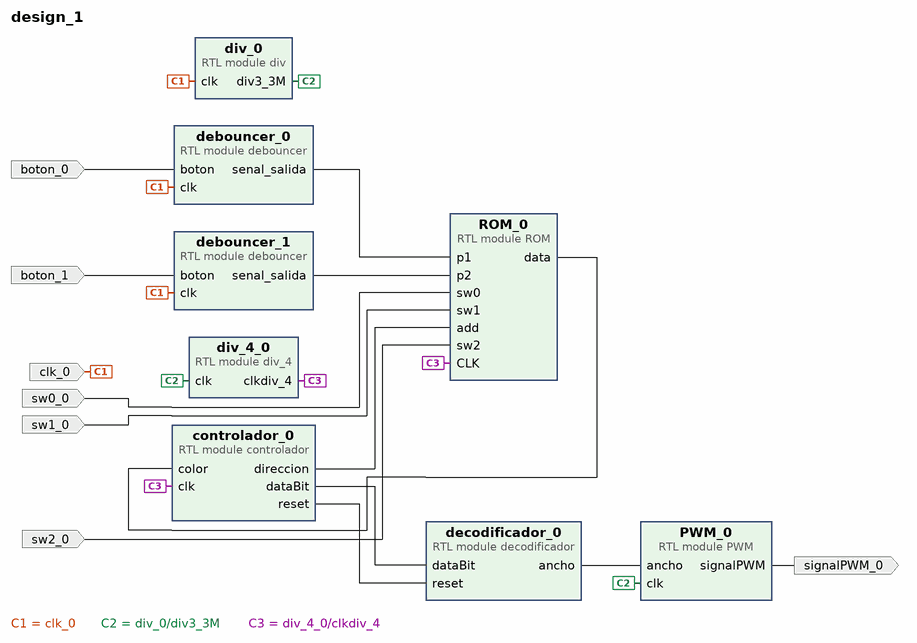
[diagram p0: block diagram of the top level]
# Vivado block design design_1, xc7s15ftgb196-1, Vivado 2022.2
create_bd_design design_1

create_bd_port -dir I -type clk clk_0
create_bd_port -dir I boton_0
create_bd_port -dir O signalPWM_0
create_bd_port -dir I boton_1
create_bd_port -dir I sw0_0
create_bd_port -dir I sw1_0
create_bd_port -dir I sw2_0

create_bd_cell -type module -reference PWM PWM_0
create_bd_cell -type module -reference controlador controlador_0
create_bd_cell -type module -reference decodificador decodificador_0
create_bd_cell -type module -reference div div_0
create_bd_cell -type module -reference div_4 div_4_0
create_bd_cell -type module -reference debouncer debouncer_0
create_bd_cell -type module -reference debouncer debouncer_1
create_bd_cell -type module -reference ROM ROM_0

# ---- connections ----

connect_bd_net [get_bd_pins PWM_0/signalPWM] [get_bd_ports signalPWM_0]
connect_bd_net [get_bd_pins ROM_0/data] [get_bd_pins controlador_0/color]
connect_bd_net -net boton_0_1 [get_bd_ports boton_0] [get_bd_pins debouncer_0/boton]
connect_bd_net -net boton_1_1 [get_bd_ports boton_1] [get_bd_pins debouncer_1/boton]
connect_bd_net -net clk_0_1 [get_bd_ports clk_0] [get_bd_pins div_0/clk] [get_bd_pins debouncer_0/clk] [get_bd_pins debouncer_1/clk]
connect_bd_net [get_bd_pins controlador_0/dataBit] [get_bd_pins decodificador_0/dataBit]
connect_bd_net [get_bd_pins controlador_0/direccion] [get_bd_pins ROM_0/add]
connect_bd_net [get_bd_pins controlador_0/reset] [get_bd_pins decodificador_0/reset]
connect_bd_net [get_bd_pins debouncer_0/senal_salida] [get_bd_pins ROM_0/p1]
connect_bd_net [get_bd_pins debouncer_1/senal_salida] [get_bd_pins ROM_0/p2]
connect_bd_net [get_bd_pins decodificador_0/ancho] [get_bd_pins PWM_0/ancho]
connect_bd_net [get_bd_pins div_0/div3_3M] [get_bd_pins div_4_0/clk] [get_bd_pins PWM_0/clk]
connect_bd_net [get_bd_pins div_4_0/clkdiv_4] [get_bd_pins controlador_0/clk] [get_bd_pins ROM_0/CLK]
connect_bd_net -net sw0_0_1 [get_bd_ports sw0_0] [get_bd_pins ROM_0/sw0]
connect_bd_net -net sw1_0_1 [get_bd_ports sw1_0] [get_bd_pins ROM_0/sw1]
connect_bd_net -net sw2_0_1 [get_bd_ports sw2_0] [get_bd_pins ROM_0/sw2]

validate_bd_design
save_bd_design
